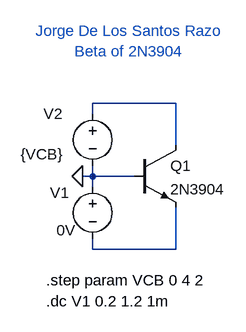
[diagram p0: schematic current-gain.asc]
current-gain.asc, the LTspice schematic file:
Version 4.1
SHEET 1 880 680
WIRE 336 16 208 16
WIRE 208 32 208 16
WIRE 336 80 336 16
WIRE 208 128 208 112
WIRE 208 128 192 128
WIRE 272 128 208 128
WIRE 208 144 208 128
WIRE 208 240 208 224
WIRE 336 240 336 176
WIRE 336 240 208 240
FLAG 192 128 0
SYMBOL npn 272 80 R0
SYMATTR InstName Q1
SYMATTR Value 2N3904
SYMBOL voltage 208 16 R0
WINDOW 0 -76 16 Left 2
WINDOW 3 -111 78 Left 2
SYMATTR InstName V2
SYMATTR Value {VCB}
SYMBOL voltage 208 128 R0
WINDOW 0 -66 25 Left 2
WINDOW 3 -56 83 Left 2
SYMATTR InstName V1
SYMATTR Value 0V
TEXT 136 288 Left 2 !.step param VCB 0 4 2
TEXT 136 320 Left 2 !.dc V1 0.2 1.2 1m
TEXT 264 -80 Center 2 ;Jorge De Los Santos Razo\nBeta of 2N3904

The netlist it stands for:
* current-gain.asc
Q1 N001 0 N002 0 2N3904
V2 N001 0 {VCB}
V1 0 N002 0V
.model NPN NPN
.model PNP PNP
.lib standard.bjt
.step param VCB 0 4 2
.dc V1 0.2 1.2 1m
* Jorge De Los Santos Razo
* Beta of 2N3904
.backanno
.end